# EAGLE design v4.2.1 Embutida (EAGLE 9.6.2)
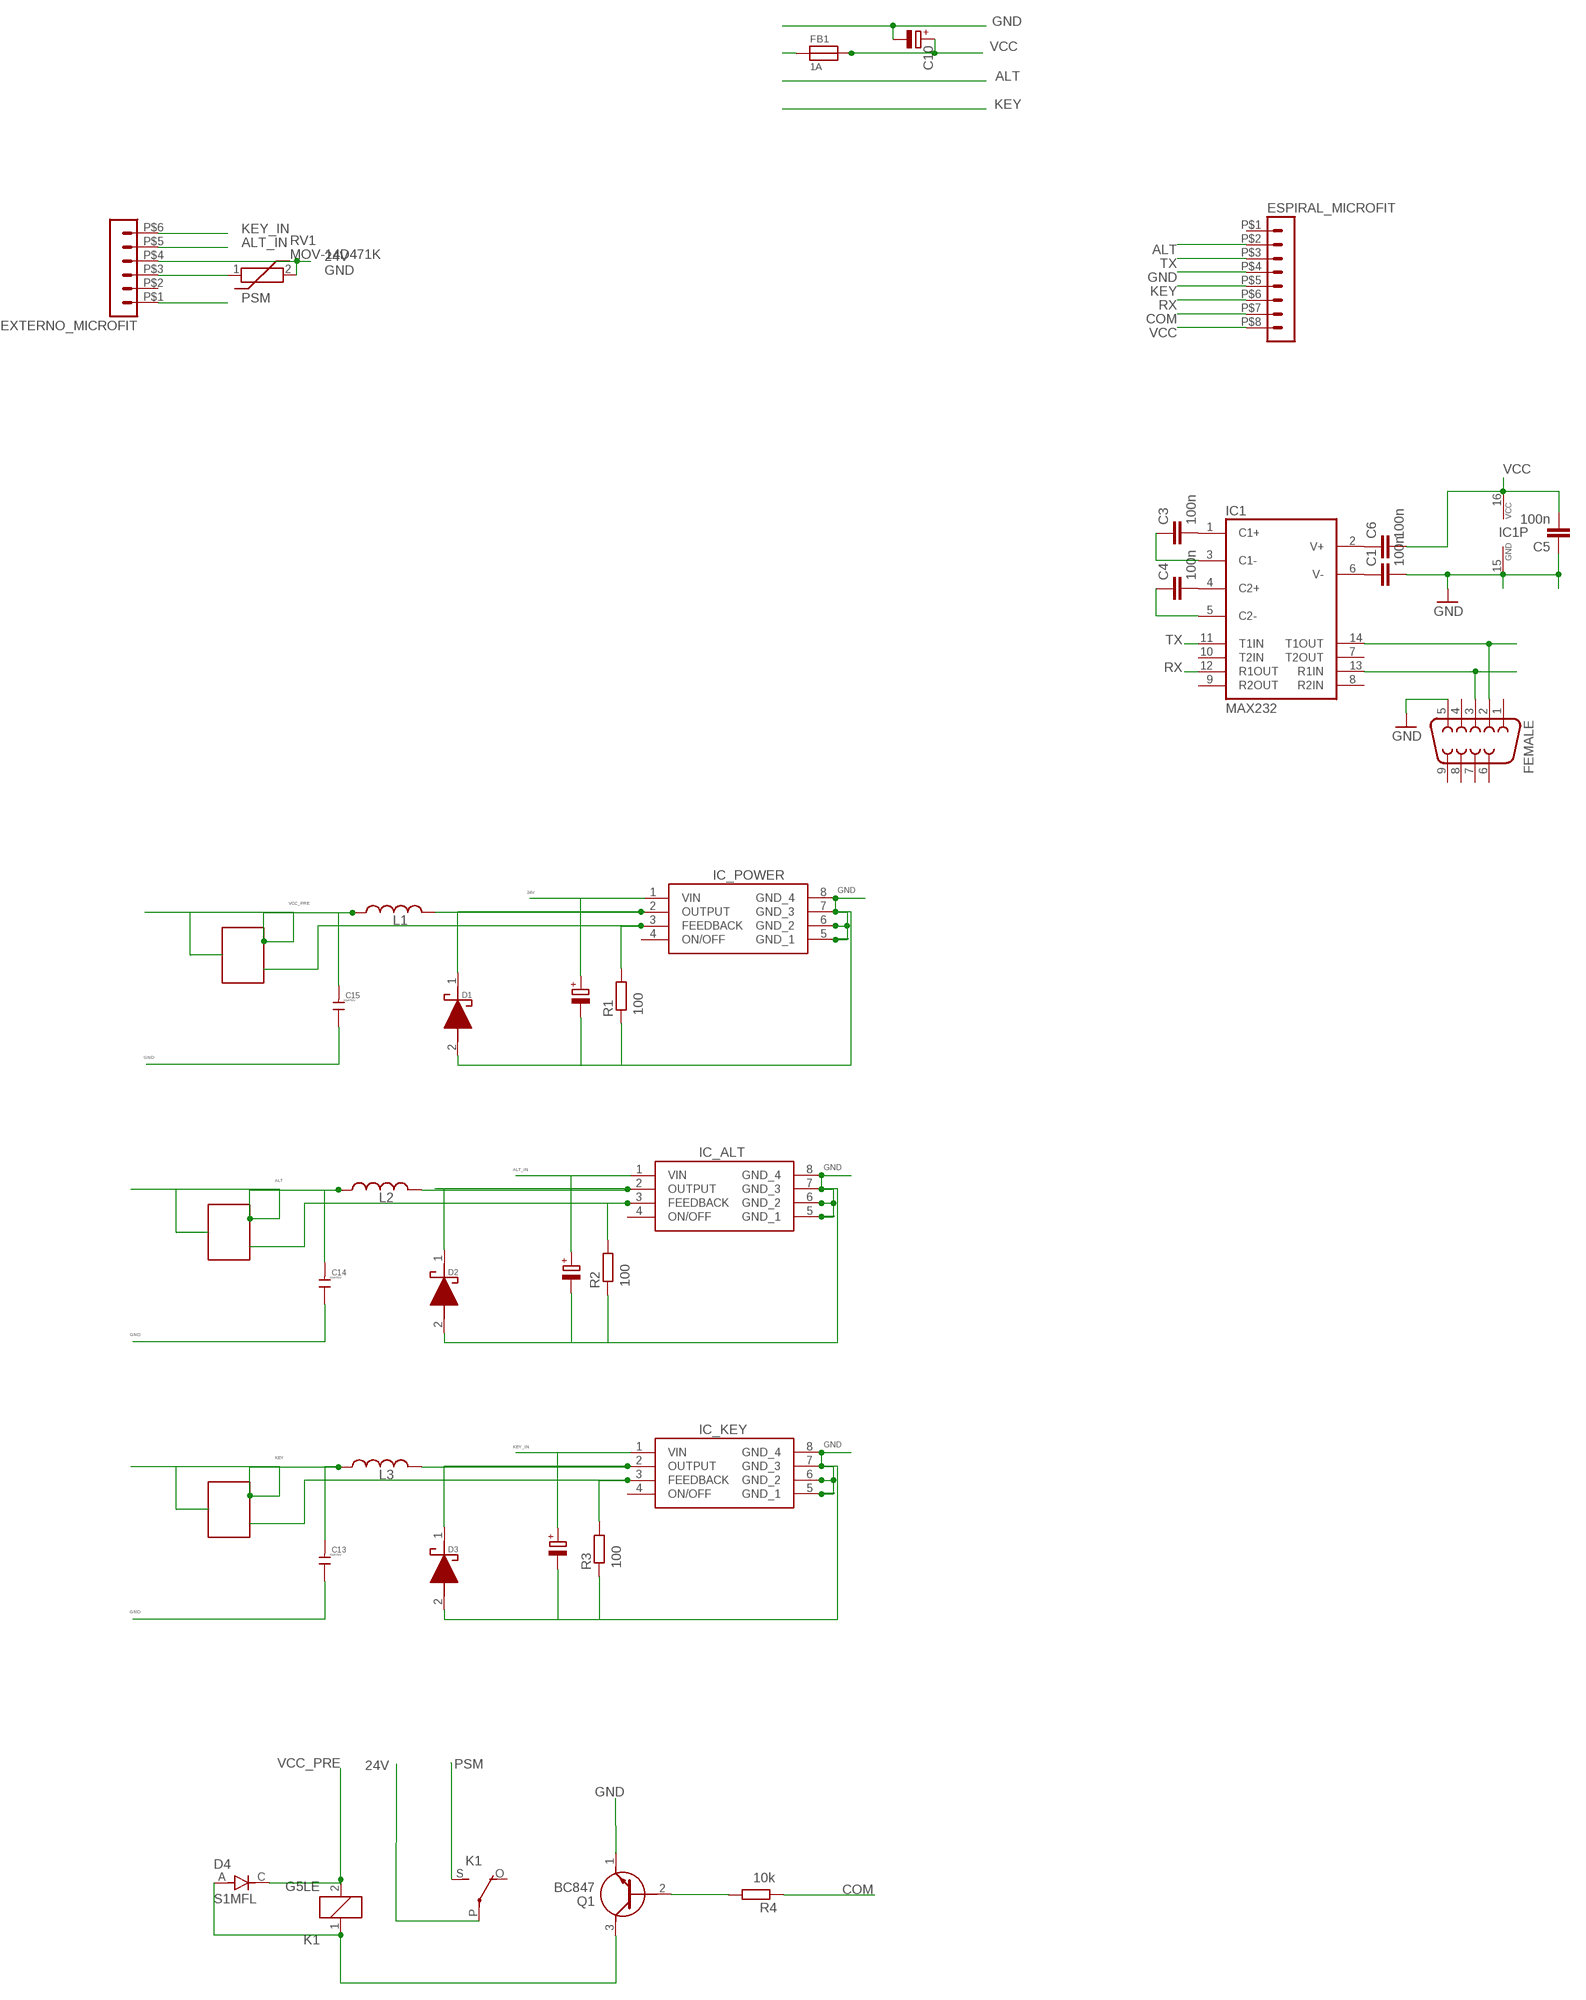
[diagram p0: schematic, sheet 1]

## Parts
C1  100n  C-EUC0805  [C0805]
C2  22uF/50v  CPOL-EUD  [PANASONIC_D]
C3  100n  C-EUC0805  [C0805]
C4  100n  C-EUC0805  [C0805]
C5  100n  C-EUC0805  [C0805]
C6  100n  C-EUC0805  [C0805]
C8  22uF/50V  CPOL-EUD  [PANASONIC_D]
C9  22uF/50V  CPOL-EUD  [PANASONIC_D]
C10  CPOL-EUB45181C  [B45181C]
C13  10uF/50V  C-0805  [C0805]
C14  10uF/50V  C-0805  [C0805]
C15  10uF/50V  C-0805  [C0805]
D1  1N5819HW1-7-F  [SODFL3518X115N]
D2  1N5819HW1-7-F  [SODFL3518X115N]
D3  1N5819HW1-7-F  [SODFL3518X115N]
D4  S1MFL  [SODFL3617X108N]
ESPIRAL_MICROFIT  HEADER_POS8_43045-0800  [43045-0800]
EXTERNO_MICROFIT  HEADER_POS6_43045-0600  [43045-0600]
FB1  1A  FERRITE0805  [0805]
FEMALE  F09H  [F09H]
IC1  MAX232  MAX232ECWES  [SO16]
IC_ALT  XL1509-3.3E1  [SOIC127P600X175-8N]
IC_KEY  XL1509-3.3E1  [SOIC127P600X175-8N]
IC_POWER  XL1509-3.3E1  [SOIC127P600X175-8N]
K1  G5LE  [G5LE]
L1  47uH  INDUCTOR  [SDE0604A-470M]
L2  47uH  INDUCTOR  [SDE0604A-470M]
L3  47uH  INDUCTOR  [SDE0604A-470M]
Q1  BC847  [BC847]
R1  100  R-EU_R0805  [R0805]
R2  100  R-EU_R0805  [R0805]
R3  100  R-EU_R0805  [R0805]
R4  10k  R-EU_R0805  [R0805]
RV1  MOV-14D471K  [MOV14D471K]
T1  TRIMPOT 10K  TRIMPOT  [TRIMPOT]
T2  TRIMPOT 10K  TRIMPOT  [TRIMPOT]
T3  TRIMPOT 10K  TRIMPOT  [TRIMPOT]

## Nets
24V: C2.+ EXTERNO_MICROFIT.P$4 IC_POWER.1(VIN) K1.P(2:P) RV1.2
ALT: C14.2 ESPIRAL_MICROFIT.P$2 L2.1 T2.VCC1 T2.VCC2
ALT_IN: C8.+ EXTERNO_MICROFIT.P$5 IC_ALT.1(VIN)
COM: ESPIRAL_MICROFIT.P$7 R4.1
GND: C1.2 C2.- C5.1 C8.- C9.- C10.- C13.1 C14.1 C15.1 D1.2(A) D2.2(A) D3.2(A) ESPIRAL_MICROFIT.P$4 EXTERNO_MICROFIT.P$3 FEMALE.5 IC1.15(GND) IC_ALT.5(GND_1) IC_ALT.6(GND_2) IC_ALT.7(GND_3) IC_ALT.8(GND_4) IC_KEY.5(GND_1) IC_KEY.6(GND_2) IC_KEY.7(GND_3) IC_KEY.8(GND_4) IC_POWER.5(GND_1) IC_POWER.6(GND_2) IC_POWER.7(GND_3) IC_POWER.8(GND_4) Q1.1(E) R1.1 R2.1 R3.1 RV1.1
KEY: C13.2 ESPIRAL_MICROFIT.P$5 L3.1 T3.VCC1 T3.VCC2
KEY_IN: C9.+ EXTERNO_MICROFIT.P$6 IC_KEY.1(VIN)
N$1: D1.1(K) IC_POWER.2(OUTPUT) L1.2
N$2: D2.1(K) IC_ALT.2(OUTPUT) L2.2
N$4: IC_ALT.3(FEEDBACK) R2.2 T2.OUT
N$5: D3.1(K) IC_KEY.2(OUTPUT) L3.2
N$6: IC_KEY.3(FEEDBACK) R3.2 T3.OUT
N$7: D4.A K1.1 Q1.3(C)
N$8: IC_POWER.3(FEEDBACK) R1.2 T1.OUT
N$10: Q1.2(B) R4.2
N$11: C3.2 IC1.1(C1+)
N$12: C4.2 IC1.4(C2+)
N$13: C3.1 IC1.3(C1-)
N$17: C4.1 IC1.5(C2-)
N$18: C6.1 IC1.2(V+)
N$19: C1.1 IC1.6(V-)
N$20: FEMALE.2 IC1.14(T1OUT)
N$30: FEMALE.3 IC1.13(R1IN)
PSM: EXTERNO_MICROFIT.P$1 K1.S(2:S)
RX: ESPIRAL_MICROFIT.P$6 IC1.12(R1OUT)
TX: ESPIRAL_MICROFIT.P$3 IC1.11(T1IN)
VCC: C5.2 C6.2 C10.+ ESPIRAL_MICROFIT.P$8 FB1.2 IC1.16(VCC)
VCC_PRE: C15.2 D4.C FB1.1 K1.2 L1.1 T1.VCC1 T1.VCC2
Unconnected: ESPIRAL_MICROFIT.P$1 EXTERNO_MICROFIT.P$2 FEMALE.1 FEMALE.4 FEMALE.6 FEMALE.7 FEMALE.8 FEMALE.9 IC1.7(T2OUT) IC1.8(R2IN) IC1.9(R2OUT) IC1.10(T2IN) IC_ALT.4(ON/OFF) IC_KEY.4(ON/OFF) IC_POWER.4(ON/OFF) K1.O(2:O)

## Library data of the parts
C1 C3-C6 = rcl@1:C-EU: CAPACITOR, European symbol; MPN: C0805C104K8RACAUTO; SPICEPREFIX: C
C2 C8 C9 = rcl:CPOL-EU: POLARIZED CAPACITOR, European symbol; MPN: EEH-ZA1H220P; SPICEPREFIX: C
C10 = supercap:CPOL-EU: POLARIZED CAPACITOR, European symbol; SPICEPREFIX: C
C13-C15 = discrete:C*: Ceramic Capacitors; MPN: C2012X5R1H106K125AC
D1-D3 = 1N5819HW1-7-F:1N5819HW1-7-F: 1N5819 Schottky Diode 40V 1A SOD123F Source: Datasheet <https://www.diodes.com/assets/Datasheets/1N5819HW1.pdf>; ARROW_PART_NUMBER: 1N5819HW1-7-F; ARROW_PRICE-STOCK: https://www.arrow.com/en/products/1n5819hw1-7-f/diodes-incorporated?region=nac; DESCRIPTION: 1N5819 Schottky Diode 40V 1A SOD123F; HEIGHT: 1.15mm; MANUFACTURER_NAME: Diodes Inc.; MANUFACTURER_PART_NUMBER: 1N5819HW1-7-F; MOUSER_PART_NUMBER: 621-1N5819HW1-7-F; MOUSER_PRICE-STOCK: https://www.mouser.co.uk/ProductDetail/Diodes-Incorporated/1N5819HW1-7-F?qs=60RJRzIpcl9ACQG7Zn63jQ%3D%3D; MPN: 1N5822 SS34
D4 = S1MFL:S1MFL: Diode Standard 1000V 1A Surface Mount SOD-123F Check availability <https://pricing.snapeda.com/parts/S1MFL/onsemi/view-part?ref=eda>; AVAILABILITY: In Stock; CHECK_PRICES: https://www.snapeda.com/parts/S1MFL/Onsemi/view-part/?ref=eda; DESCRIPTION: Diode 1000 V 1A Surface Mount SOD-123F; MF: onsemi; MP: S1MFL; PACKAGE: SOD-123F ON Semiconductor; PRICE: None; PURCHASE-URL: https://www.snapeda.com/api/url_track_click_mouser/?unipart_id=7151124&manufacturer=onsemi&part_name=S1MFL&search_term=None; SNAPEDA_LINK: https://www.snapeda.com/parts/S1MFL/Onsemi/view-part/?ref=snap
ESPIRAL_MICROFIT = con-molex-micro-fit-3_0 (1):HEADER_POS8_?: Molex - Micro-Fit 3.0 Series connector, 3.00mm (0.118") pitch header, 8 positions.; MPN: 43045-0800
EXTERNO_MICROFIT = con-molex-micro-fit-3_0 (1):HEADER_POS6_?: Molex - Micro-Fit 3.0 Series connector, 3.00mm (0.118") pitch header, 6 positions.; MPN: 43045-0600
FB1 = microbuilder:FERRITE: Ferrite Bead 0603 MMZ1608B121C - 120 Ohm, 600mA Ferrite Chip - Digikey: 445-2164-1-ND BK1608HW121-T - 120 Ohm, 600mA Ferrite Chip - Digikey: 587-1876-2-ND 0805 HZ0805B272R-10 - 2.7K Ohm @ 100MHz, 200mA 0.8 Ohm DC Resistance - Digikey: 240-2504-1-ND (see also Murata BLM21BD272SN1L); MPN: BLM21AG121SN1D
FEMALE = con-subd:F09: SUB-D; MPN: FEMALE DR9; OC_FARNELL: unknown; OC_NEWARK: unknown
IC1 = maxim-6b:MAX232ECWE: RS232 TRANSEIVER; MPN: MAX3232CSE+
IC_ALT IC_KEY IC_POWER = XL1509-3.3E1:XL1509-3.3E1: 40V 2A SOP-8_150mil DC-DC Converters RoHS Source: Datasheet <https://datasheet.lcsc.com/szlcsc/XLSEMI-XL1509-3-3E1_C74193.pdf>; DESCRIPTION: 40V 2A SOP-8_150mil DC-DC Converters RoHS; HEIGHT: 1.75mm; MANUFACTURER_NAME: XLSEMI; MANUFACTURER_PART_NUMBER: XL1509-3.3E1; MPN: XL1509-ADJE1
K1 = relay:G5LE: RELAY 1 x switch, 10 A/120 V AC, 8 A/30 V DC, Omron
L1-L3 = passives:INDUCTOR: A very specific inductor; MPN: SDE0604A-470M
Q1 = BC847:BC847: Epitaxial Planar NPN transistor Source: Datasheet <https://datasheet.datasheetarchive.com/originals/distributors/Datasheets-16/DSA-311605.pdf>; DESCRIPTION: Epitaxial Planar NPN transistor; HEIGHT: 1.3mm; MANUFACTURER_NAME: KEC; MANUFACTURER_PART_NUMBER: BC847
R1-R4 = rcl:R-EU_: RESISTOR, European symbol; MPN: RA73F2A100RBTDF; SPICEPREFIX: R
RV1 = MOV-14D471K:MOV-14D471K: Bourns MOV-14D Series Metal Oxide Varistor 430pF 50A, Clamping 775V, Varistor 470V Source: Datasheet <https://www.bourns.com/data/global/pdfs/MOV14D.pdf> Check availability <https://pricing.snapeda.com/parts/MOV-14D471K/Bourns/view-part?ref=eda>; AVAILABILITY: In Stock; CHECK_PRICES: https://www.snapeda.com/parts/MOV-14D471K/Bourns/view-part/?ref=eda; DESCRIPTION: MOV-14D Series Metal Oxide Varistor 430pF 50A, Clamping 775V, Varistor 470V | Bourns MOV-14D471K; MF: Bourns; MP: MOV-14D471K; PACKAGE: Disc-14 Bourns; PRICE: None; SNAPEDA_LINK: https://www.snapeda.com/parts/MOV-14D471K/Bourns/view-part/?ref=snap
T1-T3 = TRIMPOT:TRIMPOT; MPN: EVM3ESX50B14

## Module LDR
Ports: 

### Library data of the parts

## Net classes
1 New Class: width 0.5 mm, drill 1 mm

## Board
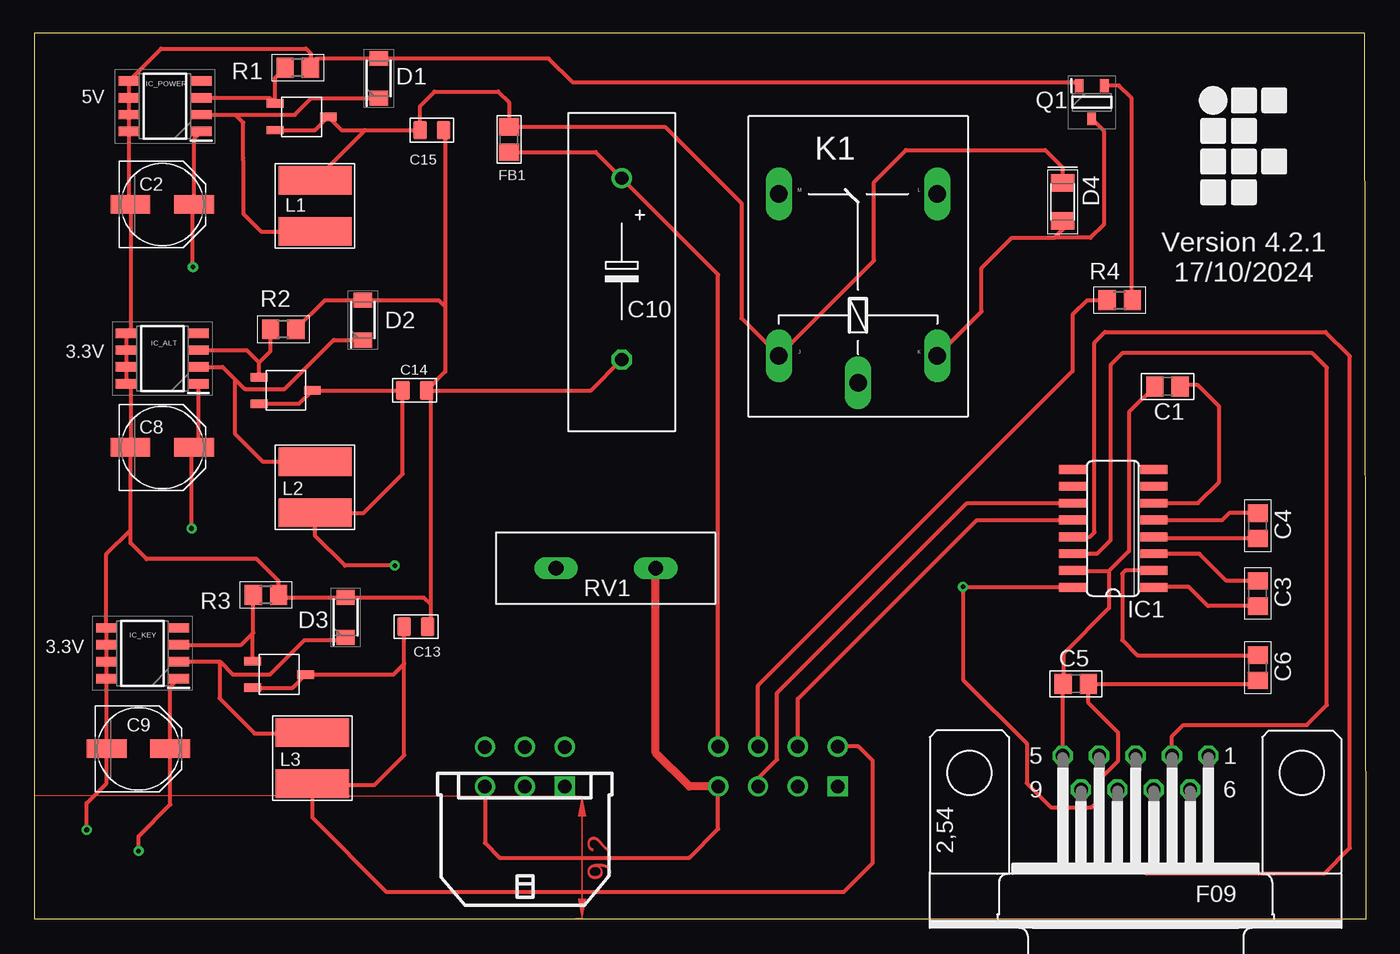
[diagram p1: board, top side]
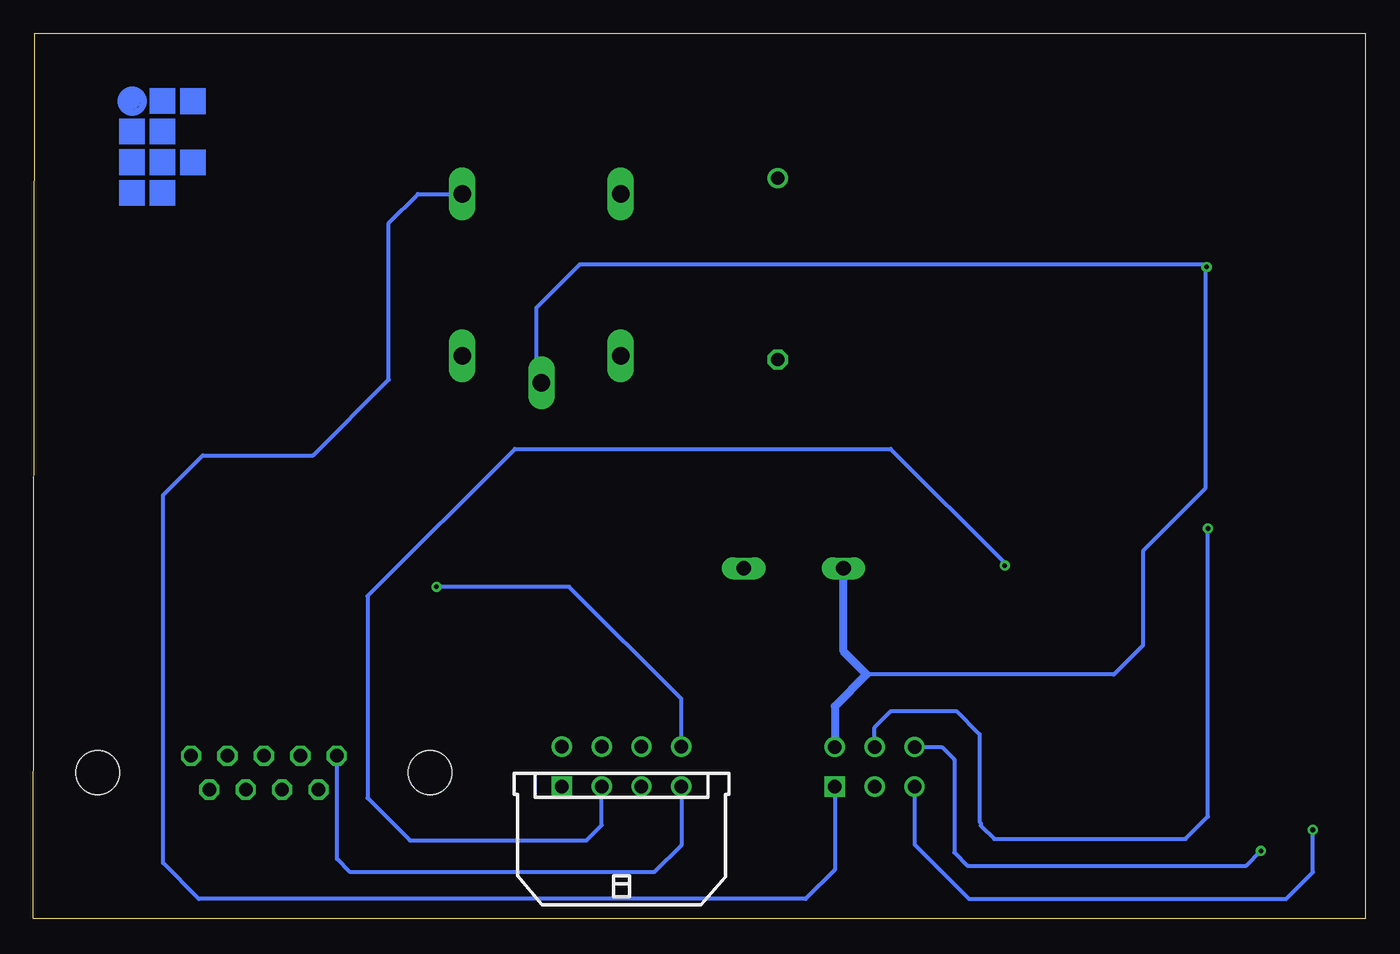
[diagram p2: board, bottom side, seen from below]

Size 100.32 x 66.7 mm. Coordinates in mm from the lower left corner, seen from the top.
Outline: 0,0 100.32,0 100.2,66.7 0,66.7 0,0
Copper layers (1*16): Top 0.035mm / dielectric 1.5mm / Bottom 0.035mm
Design rules "default *": minimum track width 6mil, minimum drill 0.35mm, track to track 6mil, track to pad 6mil, pad to pad 6mil, via to via 6mil, smd to smd 6mil, copper to edge 40mil, drill to drill 6mil, minimum pad ring 10mil, minimum via ring 8mil, stop-mask expansion 4mil, vias tented up to drill 0mil, thermal gap 10mil

### Footprints (pad centres in the part's own frame; a part is rotated, then mirrored left to right if it is on the bottom)
C0805 = smd 1.3 x 1.5: 1 -0.95,0; 2 0.95,0
PANASONIC_D = smd 3 x 1.4: + 2.4,0; - -2.4,0
B45181C = drill 1: + -12.58,0 | drill 1 octagon: - 1.08,0
C0805' = smd 1.016 x 1.397: 1 -0.889,0; 2 0.889,0
SODFL3518X115N = smd 1.12 x 1.37: 1 -1.5,0; 2 1.5,0
SODFL3617X108N = smd 1.34 x 1.8: A 1.43,0; C -1.43,0
43045-0800 = drill 1.02 square: P$1 4.5,4.32 | drill 1.02: P$2 1.5,4.32; P$3 -1.5,4.32; P$4 -4.5,4.32; P$5 4.5,7.32; P$6 1.5,7.32; P$7 -1.5,7.32; P$8 -4.5,7.32
43045-0600 = drill 1.02 square: P$1 3,4.32 | drill 1.02: P$2 0,4.32; P$3 -3,4.32; P$4 3,7.32; P$5 0,7.32; P$6 -3,7.32
0805 = smd 1.3 x 1.5: 1 -0.95,0; 2 0.95,0
F09H = drill 1.016 octagon: 1 -5.486,-1.27; 2 -2.743,-1.27; 3 0,-1.27; 4 2.743,-1.27; 5 5.486,-1.27; 6 -4.115,1.27; 7 -1.372,1.27; 8 1.372,1.27; 9 4.115,1.27 | hole 3.302: -12.522,0; 12.522,0
SO16 = smd 0.66 x 2.032: 1 -4.445,-3.073; 2 -3.175,-3.073; 3 -1.905,-3.073; 4 -0.635,-3.073; 5 0.635,-3.073; 6 1.905,-3.073; 7 3.175,-3.073; 8 4.445,-3.073; 9 4.445,3.073; 10 3.175,3.073; 11 1.905,3.073; 12 0.635,3.073; 13 -0.635,3.073; 14 -1.905,3.073; 15 -3.175,3.073; 16 -4.445,3.073
SOIC127P600X175-8N = smd 1.55 x 0.7: 1 -2.725,1.905; 2 -2.725,0.635; 3 -2.725,-0.635; 4 -2.725,-1.905; 5 2.725,-1.905; 6 2.725,-0.635; 7 2.725,0.635; 8 2.725,1.905
G5LE = drill 1.321 long: 1 -7.493,-5.969; 2 -7.493,5.969; O 4.699,5.969; P -9.525,0; S 4.699,-5.969
SDE0604A-470M = smd 2.15 x 5.5: 1 -1.931,0; 2 1.931,0
BC847 = smd 0.95 x 0.65: 1 -1.25,-0.95; 2 -1.25,0.95; 3 1.25,0
R0805 = smd 1.3 x 1.5: 1 -0.95,0; 2 0.95,0
MOV14D471K = drill 1.1 pad 1.65 long: 1 -3.75,0; 2 3.75,0
TRIMPOT = smd 1.27 x 0.635: OUT 0.5,0.5; VCC1 -3.5,1.5; VCC2 0.5,2.5

### Placement (x,y rotation side)
C1  85.34,40.09 180 top
C2  9.64,53.79 0 top
C3  92.14,24.49 270 top
C4  92.14,29.59 270 top
C5  78.44,17.69 0 top
C6  92.14,18.89 270 top
C8  9.64,35.49 0 top
C9  7.84,12.79 0 top
C10  44.24,43.19 270 top
C13  10uF/50V  [C0805']  28.74,21.99 180 top
C14  10uF/50V  [C0805']  28.64,39.79 180 top
C15  10uF/50V  [C0805']  29.94,59.39 180 top
D1  25.94,63.29 90 top
D2  24.74,45.09 90 top
D3  23.44,22.69 90 top
D4  77.44,53.99 270 top
ESPIRAL_MICROFIT  56.01,5.64 0 top
EXTERNO_MICROFIT  36.94,5.62 0 top
FB1  35.74,58.69 270 top
FEMALE  82.94,10.99 180 top
IC1  81.24,29.39 90 top
IC_ALT  9.64,42.19 180 top
IC_KEY  8.14,19.99 180 top
IC_POWER  9.84,61.19 180 top
K1  62.04,49.89 90 top
L1  21.14,53.69 270 top
L2  21.14,32.49 90 top
L3  20.94,12.09 90 top
Q1  79.64,61.49 270 top
R1  19.84,64.09 180 top
R2  18.74,44.39 180 top
R3  17.44,24.39 180 top
R4  81.74,46.59 0 top
RV1  43.04,26.39 180 top
T1  18.64,61.89 180 top
T2  17.44,41.29 180 top
T3  16.94,19.89 180 top

### Tracks (layer width: path | path; a pad name or v marks a point on that pad's centre or on a via)
24V  (via drill 0.35)
  Top 0.305: IC_POWER.1 12.04,58.76 C2.+ 11.94,53.69 v11.94,49.09
  Bottom 0.305: K1.P 62.44,40.77 62.44,45.99 59.14,49.29 12.14,49.29 v11.94,49.09 12.04,48.99 12.04,32.39 16.74,27.69 16.74,20.59 18.94,18.39 37.54,18.39
  Bottom 0.61: EXTERNO_MICROFIT.P$4 39.94,15.99 37.54,18.39 39.29,20.14 RV1.2
ALT  (via drill 0.35)
  Top 0.305: T2.VCC2 19.94,38.79 T2.VCC1 C14.2 27.75,33.51 24.81,30.56 L2.1 21.14,28.84 23.39,26.59 v27.14,26.59
  Bottom 0.305: v27.14,26.59 27.14,26.79 35.74,35.39 64.04,35.39 75.14,24.29 75.14,9.09 71.94,5.89 58.64,5.89 57.51,7.03 ESPIRAL_MICROFIT.P$2
ALT_IN  (via drill 0.35)
  Top 0.305: IC_ALT.1 12.37,35.82 C8.+ 11.84,35.29 v11.84,29.39
  Bottom 0.305: EXTERNO_MICROFIT.P$5 36.94,14.39 35.74,15.59 30.74,15.59 29.04,13.89 29.04,7.29 28.94,7.19 28.94,6.99 27.94,5.99 13.54,5.99 11.84,7.69 v11.84,29.39
COM
  Top 0.305: ESPIRAL_MICROFIT.P$7 54.51,17.56 78.19,41.24 78.19,45.49 79.29,46.59 R4.1
GND  (via drill 0.35)
  Top 0.305: C1.2 82.44,38.14 82.44,27.69 80.94,26.19 | IC1.15 78.2,26.19 80.94,26.19 | 80.94,26.19 80.94,23.39 77.49,19.94 77.49,17.99 | 77.49,17.99 C5.1 | FEMALE.5 77.46,17.96 77.49,17.99 | 29.83,23.69 29.83,39.49 C14.1 | 29.83,23.69 29.83,22.19 C13.1 | 30.94,46.09 30.94,59.28 C15.1 | 30.94,46.09 30.94,41.21 C14.1 | R2.1 21.89,46.59 D2.2 30.44,46.59 30.94,46.09 | v3.94,6.69 3.94,8.69 5.44,10.19 C9.- 5.42,12.82 IC_KEY.8 IC_KEY.7 IC_KEY.6 IC_KEY.5 5.42,27.47 7.24,29.29 | EXTERNO_MICROFIT.P$3 33.94,5.69 35.04,4.59 49.34,4.59 51.51,6.76 ESPIRAL_MICROFIT.P$4 | 7.24,29.29 C8.- 7.24,39.96 IC_ALT.8 IC_ALT.7 IC_ALT.6 IC_ALT.5 7.24,44.42 C2.- 7.12,53.92 IC_POWER.8 IC_POWER.7 IC_POWER.6 IC_POWER.5 9.55,65.53 20.46,65.53 20.79,65.19 R1.1 20.79,64.29 21.29,64.79 D1.2 38.74,64.79 40.54,62.99 78.44,62.99 Q1.1 | 29.83,23.69 29.33,24.19 D3.2 18.59,24.19 R3.1 18.39,25.44 16.74,27.09 8.44,27.09 7.24,28.29 7.24,29.29 | C14.1 41.92,39.79 C10.-
  Top 0.61: ESPIRAL_MICROFIT.P$4 49.33,9.96 46.79,12.49 RV1.1
  Bottom 0.305: ESPIRAL_MICROFIT.P$4 51.51,5.53 53.54,3.49 76.44,3.49 77.44,4.49 77.44,12.25 FEMALE.5 | EXTERNO_MICROFIT.P$3 33.94,5.59 29.84,1.49 5.94,1.49 3.94,3.49 v3.94,6.69
KEY
  Top 0.305: ESPIRAL_MICROFIT.P$5 62.08,12.96 63.14,11.89 63.14,4.19 60.94,1.99 26.54,1.99 20.94,7.59 L3.1 21.06,10.04 25.59,10.04 27.85,12.31 27.85,19.19 | T3.VCC2 19.44,17.39 T3.VCC1 27.05,18.39 27.85,19.19 | 27.85,19.19 C13.2
KEY_IN  (via drill 0.35)
  Top 0.305: v7.84,5.09 7.84,6.19 10.24,8.59 C9.+ 10.24,17.46 IC_KEY.1
  Bottom 0.305: EXTERNO_MICROFIT.P$6 31.89,12.94 30.94,11.99 30.94,4.99 29.94,3.99 8.94,3.99 v7.84,5.09
N$1
  Top 0.305: IC_POWER.2 15.14,60.56 | 15.14,60.56 19.61,60.56 20.84,61.79 D1.1 | 15.14,60.56 15.74,59.96 15.74,57.29 15.74,57.09 15.74,53.09 17.07,51.76 L1.2
N$2
  Top 0.305: IC_ALT.2 14.18,41.56 15.09,40.64 | 15.09,40.64 15.84,39.89 18.84,39.89 22.54,43.59 D2.1 | 15.09,40.64 15.09,36.54 17.21,34.43 L2.2
N$4
  Top 0.305: T2.OUT 16.94,41.89 | IC_ALT.3 16.01,42.83 16.94,41.89 | R2.2 17.79,42.74 16.94,41.89
N$5
  Top 0.305: D3.1 23.44,20.99 20.34,20.99 17.74,18.39 14.94,18.39 13.98,19.36 | IC_KEY.2 13.98,19.36 | 13.98,19.36 13.94,19.32 13.94,16.59 16.59,13.94 20.86,13.94 L3.2
N$6
  Top 0.305: T3.OUT 16.44,21.49 | IC_KEY.3 15.58,20.63 16.44,21.49 | 16.44,21.49 16.49,21.54 R3.2
N$7
  Top 0.305: Q1.3 80.54,59.34 80.54,52.29 79.54,51.29 76.84,51.29 | K1.1 71.34,45.73 71.34,48.99 73.64,51.29 76.84,51.29 | 76.84,51.29 77.44,51.89 D4.A
N$8
  Top 0.305: IC_POWER.3 17.71,61.83 T1.OUT 18.14,63.34 R1.2
N$10
  Top 0.305: R4.2 82.64,46.64 82.64,57.79 82.64,58.09 82.64,61.79 81.69,62.74 Q1.2
N$11
  Top 0.305: C3.2 88.39,23.54 86.94,24.99 84.36,24.99 IC1.1
N$12
  Top 0.305: C4.2 84.43,28.64 IC1.4
N$13
  Top 0.305: C3.1 89.79,25.44 87.75,27.49 IC1.3
N$17
  Top 0.305: C4.1 89.99,30.54 89.44,29.99 84.35,29.99 IC1.5
N$18
  Top 0.305: IC1.2 82.17,26.22 81.94,25.99 81.94,20.99 83.09,19.84 C6.1
N$19
  Top 0.305: IC1.6 87.65,31.3 89.24,32.89 89.24,38.59 87.64,40.19 86.39,40.19 C1.1
N$20
  Top 0.305: FEMALE.2 85.69,13.74 86.54,14.59 95.84,14.59 97.34,16.09 97.34,41.49 96.24,42.59 81.94,42.59 81.04,41.69 81.04,28.49 80.04,27.49 IC1.14
N$30
  Top 0.305: IC1.13 79.51,28.76 79.84,29.09 79.84,43.39 80.64,44.19 97.24,44.19 99.07,42.36 99.07,5.33 99.03,5.28 98.97,5.23 97.14,3.39 83.74,3.39 82.94,4.19 FEMALE.3
PSM
  Bottom 0.305: EXTERNO_MICROFIT.P$1 39.94,3.69 42.14,1.49 87.84,1.49 90.54,4.19 90.54,31.89 87.54,34.89 79.24,34.89 73.54,40.59 73.54,52.39 71.34,54.59 K1.S
RX
  Top 0.305: ESPIRAL_MICROFIT.P$6 57.51,16.56 70.98,30.03 IC1.12
TX
  Top 0.305: ESPIRAL_MICROFIT.P$3 54.51,10.56 55.94,11.99 55.94,16.99 70.25,31.3 IC1.11
VCC  (via drill 0.35)
  Top 0.305: IC1.16 78.13,24.99 v69.94,24.99 69.94,17.99 74.74,13.19 74.74,10.19 76.54,8.39 79.64,8.39 80.24,8.99 80.24,10.49 81.64,11.89 81.64,13.99 79.39,16.24 C5.2 91.89,17.69 C6.2 | FB1.2 42.27,57.74 C10.+ 51.51,48.51 ESPIRAL_MICROFIT.P$8
  Bottom 0.305: ESPIRAL_MICROFIT.P$8 51.51,16.56 59.94,24.99 v69.94,24.99
VCC_PRE
  Top 0.305: T1.VCC2 21.14,59.39 T1.VCC1 23.14,59.39 24.91,59.39 | L1.1 24.91,59.39 | 24.91,59.39 C15.2 29.05,61.21 30.14,62.29 34.94,62.29 35.74,61.49 FB1.1 47.49,59.64 53.24,53.89 53.24,45.23 K1.2 63.24,49.57 63.24,55.49 65.64,57.89 76.14,57.89 77.44,56.59 D4.C
(copper drawn outside any net)
  shapes: Bottom area x9, Bottom circle x3, Top area x2

### Text on the board
tPlace: 5V | 3.3V | 3.3V
tNames: M | L | Version 4.2.1 / 17/10/2024 | J | K